# Altium schematic sheet PowerSupply.SchDoc
size 297 x 209 mm; SheetNumber: 2; SheetTotal: 3; swcgroup: FabLab; Org: Sainsbury Wellcome Centre; Add1: 25 Howland Street; Add2: London; Add3: W1T 4JG; WebAddress: www.sainsburywellcome.org; SheetSize: A4; SheetName: Power Supply
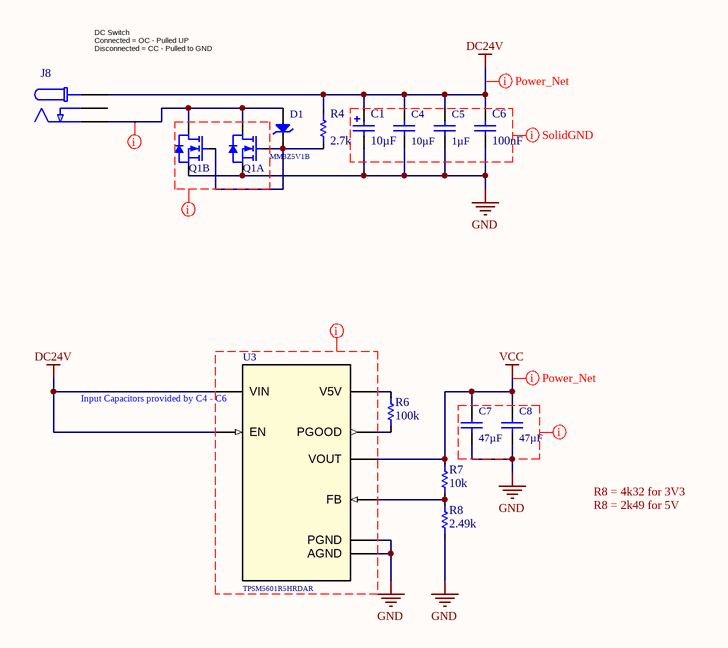
[diagram p0: PowerSupply.SchDoc]

## Parts
C1  value 10µF  [CAP_EEEFK1H100P]  (hidden comment: CPOLD-10uF-50V-20%-Alu)
C4  value 10µF  [CAPC3225X279X50NL20T25]  (hidden comment: C1210-10uF-50V-10%-X7R)
C5  value 1µF  [CAPC0805(2012)130_N]  (hidden comment: C0805-1uF-50V-10%-X7R)
C6  value 100nF  [FP-GRM188-0_1-e0_2_0_5-IPC_B]  (hidden comment: C0603-100nF-100V-10%-X7R)
C7  value 47µF  [FP-GRM32E-0_3-0_2-IPC_B]  (hidden comment: C1210-47uF-10V-10%-X7R)
C8  value 47µF  [FP-GRM32E-0_3-0_2-IPC_B]  (hidden comment: C1210-47uF-10V-10%-X7R)
D1  PartNumber: MM3Z5V1B  [SODFL250X100-2N]  (hidden comment: MM3Z10VB)
J8  694108105102  [WE_694108105102]  (value not drawn)
Q1  FDMC8030  [TRANS_FDMC8030]  (value not drawn)  (parts A,B of 2)
R4  value 2.7k  [FP-CPF0603-IPC_B]  (hidden comment: R0603-2k7-1/16W-0.1%)
R6  value 100k  [FP-CPF0603-IPC_B]  (hidden comment: R0603-100k-1/16W-0.1%)
R7  value 10k  [FP-CPF0603-IPC_B]  (hidden comment: R0603-10k-1/16W-0.1%)
R8  value 2.49k  [FP-CPF0603-IPC_B]  (hidden comment: R0603-2k49-1/16W-0.1%)
U3  TPSM5601R5HRDAR  [IC_TPSM5601R5HRDAR]

## Nets
DC24V: C1.1 C4.2 C5.2 C6.2 J8.1 R4.2 U3.1(VIN) U3.2(EN)
GND: C1.2 C4.1 C5.1 C6.1 C7.1 C8.1 Q1.4(S1) Q1.5(S2) R8.1 U3.10(AGND) U3.15(PGND)
VCC: C7.2 C8.2 R7.2 U3.7(VOUT)
NetD1_1: D1.1(A) J8.2 Q1.9(D2) Q1.10(D1)
NetD1_2: D1.2(C) Q1.1(G1) Q1.8(G2) R4.1
NetR6_1: R6.1 U3.12(PGOOD)
NetR6_2: R6.2 U3.11(V5V)
NetR7_1: R7.1 R8.2 U3.9(FB)

Not connected (* = marked no-connect by the designer): J8 3

## Layout directives
net class Power Nets: DC24V, NetD1_1, VCC
CompClassName: SolidGND: (no net found under the mark)

## Notes on the sheet
- (near J8) DC Switch
  Connected = OC - Pulled UP
  Disconnected = CC - Pulled to GND
- (near U3) Input Capacitors provided by C4 - C6
- R8 = 4k32 for 3V3
- R8 = 2k49 for 5V
- FILE
- VARIANT
- DATE
- REVISION
- SHEET
- /
- PROJECT
- SIZE

## Library data of the parts
C1 = CMP-612-0001-7: 10µF ±20% 50V SMD Aluminum Electrolytic Capacitor Surface Mount D; Lead Diameter: 0.65mm; Polarity: Polar; Ripple Current: 165mA; Capacitance: 10uF; Life (Hours): 2000Hour; Impedance: 880mR; Leakage Current: 3uA; Pick&PlaceFootprint: CPOLD; Max Operating Temperature: 105°C; Voltage Rating: 50V; Voltage: 50V; Contact Plating: Tin; Termination: SMD/SMT; Size: 5.8mm; Package Quantity: 1000; Ripple Current (AC): 165mA; Height: 5.8mm; Height - Seated (Max): 0.24inch; Lead Pitch: 1.8mm; Packaging: Tape and Reel; Radiation Hardening: No; Case/Package: CPOLD; Width: 7.8mm; Mount: Surface Mount,PCB; Length: 5.8mm; Construction: Cylindrical; Series: FK; Voltage Rating (DC): 50V; Lead Free: Lead Free; Min Operating Temperature: -55°C; ESR (Equivalent Series Resistance): 880mR; Diameter: 6.3mm; Number of Pins: 2; RoHS Compliant: Yes; REACH SVHC: No SVHC; Tolerance: 20%; RoHS: Yes; Capacitor Type: Electrolytic
C4 = CMP-611-0024-5: 10uF ±10% 50V Ceramic Capacitor X7R 1210 (3225 Metric); Pick&PlaceFootprint: C1210; Capacitance: 10uF; Capacitor Type: Ceramic; Voltage Rating: 50V; Dielectric: X7R; Tolerance: 10%; Case/Package: 1210; RoHS: Yes; Mount: Surface Mount
C5 = CMP-611-0023-3: 1uF ±10% 50V Ceramic Capacitor X7R 0805 (2012 Metric); Pick&PlaceFootprint: C0805; Capacitance: 1uF; Case Code (Imperial): 0805; Mount: SMD; Case/Package: 0805; RoHS: Yes; Case Code (Metric): 2012; Tolerance: 10%; Capacitor Type: Ceramic; Voltage Rating: 50V
C6 = CMP-611-0027-15: 0.1µF ±10% 100V Ceramic Capacitor X7R 0603 (1608 Metric); Pick&PlaceFootprint: 0603_CAP; Mount: Surface Mount; Voltage Rating: 100V; Min Operating Temperature: -55°C; Termination: SMD/SMT; Width: 0.8mm; Series: GRM; Packaging: Tape and Reel; Size: 0.8mm; Case Code (Metric): 1608; REACH SVHC: No SVHC; Case/Package: 0603; Construction: Flat; Dielectric: X7R; Weight: 0.000222oz; Height: 0.8mm; Tolerance: 10%; Package Quantity: 1; Lead Free: Lead Free; Voltage: 100V; RoHS Compliant: Yes; Capacitance: 100nF; Thickness: 0.035inch; Radiation Hardening: No; Depth: 0.8mm; Length: 1.6mm; Max Operating Temperature: 125°C; Material: Ceramic; Case Code (Imperial): 0603; Voltage Rating (DC): 100V; Capacitor Type: Ceramic; RoHS: Yes
C7 C8 = CMP-611-0031-10: 47uF ±10% 10V Ceramic Capacitor X7R 1210 (3225 Metric); Pick&PlaceFootprint: C1210; RoHS Compliant: Yes; Series: GRM; Termination: SMD/SMT; Number of Pins: 2; Package Quantity: 1; Case Code (Imperial): 1210; Mount: Surface Mount; Construction: Flat; Tolerance: 10%; Capacitance: 47uF; Depth: 2.5mm; Dielectric: X7R; Packaging: Tape and Reel; Lead Free: Lead Free; Voltage Rating: 10V; Height: 2.5mm; Case Code (Metric): 3225; Max Operating Temperature: 125°C; Thickness: 0.106inch; Case/Package: 1210; Radiation Hardening: No; Material: Ceramic; Min Operating Temperature: -55°C; Voltage Rating (DC): 10V; Voltage: 10V; Length: 3.2mm; Width: 2.5mm; REACH SVHC: No SVHC; Capacitor Type: Ceramic; RoHS: Yes
D1 = CMP-822-0001-1: DIODE ZENER 10V 200MW SOD323F; Peak Reverse Current: 1.8uA; ESD Protection: No; Element Configuration: Single; Impedance: 18R; Voltage Tolerance: 2%; Max Reverse Leakage Current: 180nA; Forward Voltage: 1V; Test Current: 5mA; Radiation Hardening: No; Packaging: Tape and Reel; Weight: 0.0276g; Max Power Dissipation: 200mW; Max Reverse Current: 180nA; Zener Voltage: 10V; Min Operating Temperature: -65°C; Mount: Surface Mount; Length: 1.3mm; Working Voltage: 10V; Tolerance: 2%; Lead Free: Lead Free; Width: 1.7mm; Max Operating Temperature: 150°C; Package Quantity: 1; Power Dissipation: 200mW; RoHS Compliant: Yes; REACH SVHC: No SVHC; Contact Plating: Tin, Matte; Number of Pins: 2; Height: 1mm
J8 = CMP-360-0003-3: DC Power Connectors WR-DC PwrJk CtrPnSMT Right Angled W/Peg; Shielding: Unshielded; Voltage Rating (DC): 24V; Insulation Resistance: 100MR; Gender: Male; Current Rating: 5A; Connector Type: Jack,Power; Max Operating Temperature: 85°C; REACH SVHC: Unknown; Housing Material: Polyamide; Packaging: Tape and Reel; Flammability Rating: UL94 V-0; Termination: SMD/SMT; Mount: Surface Mount; Package Quantity: 200; Contact Material: Copper Alloy; Min Operating Temperature: -40°C; Color: Black; Voltage Rating: 24V; Contact Plating: Tin; Contact Gender: Female
Q1 = CMP-830-0003-2: ON SEMICONDUCTOR - FDMC8030 - Dual MOSFET, Dual N Channel, 12 A, 40 V, 0.008 ohm, 10 V, 1.5 V; FET Type: 2 N-Channel; Drain to Source Resistance: 10mR; Max Power Dissipation: 800mW; Gate to Source Voltage (Vgs): 12V; Turn-Off Delay Time: 19ns; Input Capacitance: 1.975nF; Turn-On Delay Time: 7ns; Continuous Drain Current (ID): 12A; Polarity: N-CHANNEL; Fall Time: 3ns; Drain to Source Voltage (Vdss): 40V; Number of Elements: 1; Radiation Hardening: No; Length: 3mm; Min Operating Temperature: -55°C; RoHS Compliant: Yes; Mount: Surface Mount; Packaging: Tape and Reel; Element Configuration: Dual; Package Quantity: 3000; Number of Pins: 8; Weight: 0.196g; Max Operating Temperature: 150°C; Power Dissipation: 800mW; Rds On Max: 10mR; Width: 3mm; Series: PowerTrench®; Drain to Source Breakdown Voltage: 40V; Height: 0.75mm; Rise Time: 3ns
R4 = CMP-633-0031-14: Surface Mount Resistor 2k7 Ohm 1/16 W 0.1% 0603 (1608 Metric); Pick&PlaceFootprint: R0603; Voltage Rating: 50V; Power Rating: 62.5mW; Temperature Coefficient: 25ppm/°C; Number of Resistors: 1; Max Power Dissipation: 62.5 mW; Tolerance: 0.1%; Case/Package: 0603; RoHS: Yes; Resistance: 2.7k; Mount: Surface Mount; Resistance Tolerance: 0.1%; Resistor Type: Thin Film; REACH SVHC: No SVHC; Size Code: 0603; Case Code (Metric): 1608; Number of Terminations: 2; RoHS Compliant: Yes; Weight: 7.1E-05oz; Termination: Solder; Length: 1.6mm; Composition: Thin Film; Min Operating Temperature: -55°C; ELV: Compliant; Packaging: Tape and Reel; Max Operating Temperature: 155°C; Case Code (Imperial): 0603; Width: 0.8mm; Technology: Thin Film; Number of Pins: 2; Voltage Rating (DC): 50V; Height: 0.45mm; Series: CPF
R6 = CMP-633-0000-17: Surface Mount Resistor 100k Ohm 1/16 W 0.1% 0603 (1608 Metric); Number of Resistors: 1; Temperature Coefficient: 25ppm/°C; Voltage Rating (DC): 50V; Power Rating: 62.5mW; Pick&PlaceFootprint: R0603; Max Power Dissipation: 62.5 mW; Termination: Solder; Case Code (Metric): 1608; Min Operating Temperature: -55°C; Case Code (Imperial): 0603; ELV: Compliant; Height: 0.45mm; Packaging: Tape and Reel; Weight: 7.1E-05oz; Number of Pins: 2; Tolerance: 0.1%; Max Operating Temperature: 155°C; Resistance: 100k; Width: 0.8mm; Number of Terminations: 2; Composition: Thin Film; Mount: Surface Mount; Length: 1.6mm; Voltage Rating: 50V; REACH SVHC: No SVHC; Case/Package: 0603; RoHS: Yes; Technology: Thin Film; RoHS Compliant: Yes; Resistance Tolerance: 0.1%; Resistor Type: Thin Film; Size Code: 0603; Series: CPF
R7 = CMP-633-0002-15: Surface Mount Resistor 10k Ohm 1/16 W 0.1% 0603 (1608 Metric); Pick&PlaceFootprint: R0603; Power Rating: 62.5mW; Voltage Rating (DC): 50V; Number of Resistors: 1; Temperature Coefficient: 25ppm/°C; Max Power Dissipation: 62.5 mW; Height: 0.45mm; Case Code (Imperial): 0603; RoHS: Yes; Composition: Thin Film; Number of Terminations: 2; Case/Package: 0603; Min Operating Temperature: -55°C; ELV: Compliant; Mount: Surface Mount; Packaging: Tape and Reel; Max Operating Temperature: 155°C; Tolerance: 0.1%; Case Code (Metric): 1608; Resistance: 10k; REACH SVHC: No SVHC; Width: 0.8mm; Number of Pins: 2; Voltage Rating: 50V; Length: 1.6mm; Termination: Solder; Weight: 7.1E-05oz; RoHS Compliant: Yes; Size Code: 0603; Series: CPF; Resistance Tolerance: 0.1%; Technology: Thin Film; Resistor Type: Thin Film
R8 = CMP-633-0082-1: Surface Mount Resistor 2.49k Ohm 1/16 W 0.1% 0603 (1608 Metric); Voltage Rating: 50V; Number of Resistors: 1; Pick&PlaceFootprint: R0603; Max Power Dissipation: 62.5 mW; Temperature Coefficient: 25ppm/°C; Power Rating: 62.5mW; Length: 1.6mm; Min Operating Temperature: -55°C; Resistance Tolerance: 0.1%; Number of Terminations: 2; Technology: THIN FILM; REACH SVHC: Yes; Case/Package: 0603; RoHS: Yes; Mount: Surface Mount; Weight: 7.1E-05oz; RoHS Compliant: Yes; Composition: Thin Film; Voltage Rating (DC): 50V; Case Code (Metric): 1608; Construction: Chip; Max Operating Temperature: 155°C; Tolerance: 0.1%; Resistor Type: FIXED RESISTOR; Width: 0.8mm; ELV: Compliant; Series: CPF; Packaging: Tape and Reel; Number of Pins: 2; Resistance: 2.49k; Size Code: 0603; Termination: Wraparound; Height: 0.45mm; Case Code (Imperial): 0603
U3 = CMP-A10-0005-5: 60-V input, 1-V to 16-V output, 1.5-A power module in enhanced HotRod™ QFN package 15-B3QFN -40 to 125; pin to pad: 1>1+14 7>7+8 15>15+16+17+18+19+20+21+22+23+24+25+26; Pick&PlaceFootprint: B3QFN; PartNumber: TPSM5601R5HRDAR